# EAGLE design attinytrafficlight (EAGLE 7.5.0)
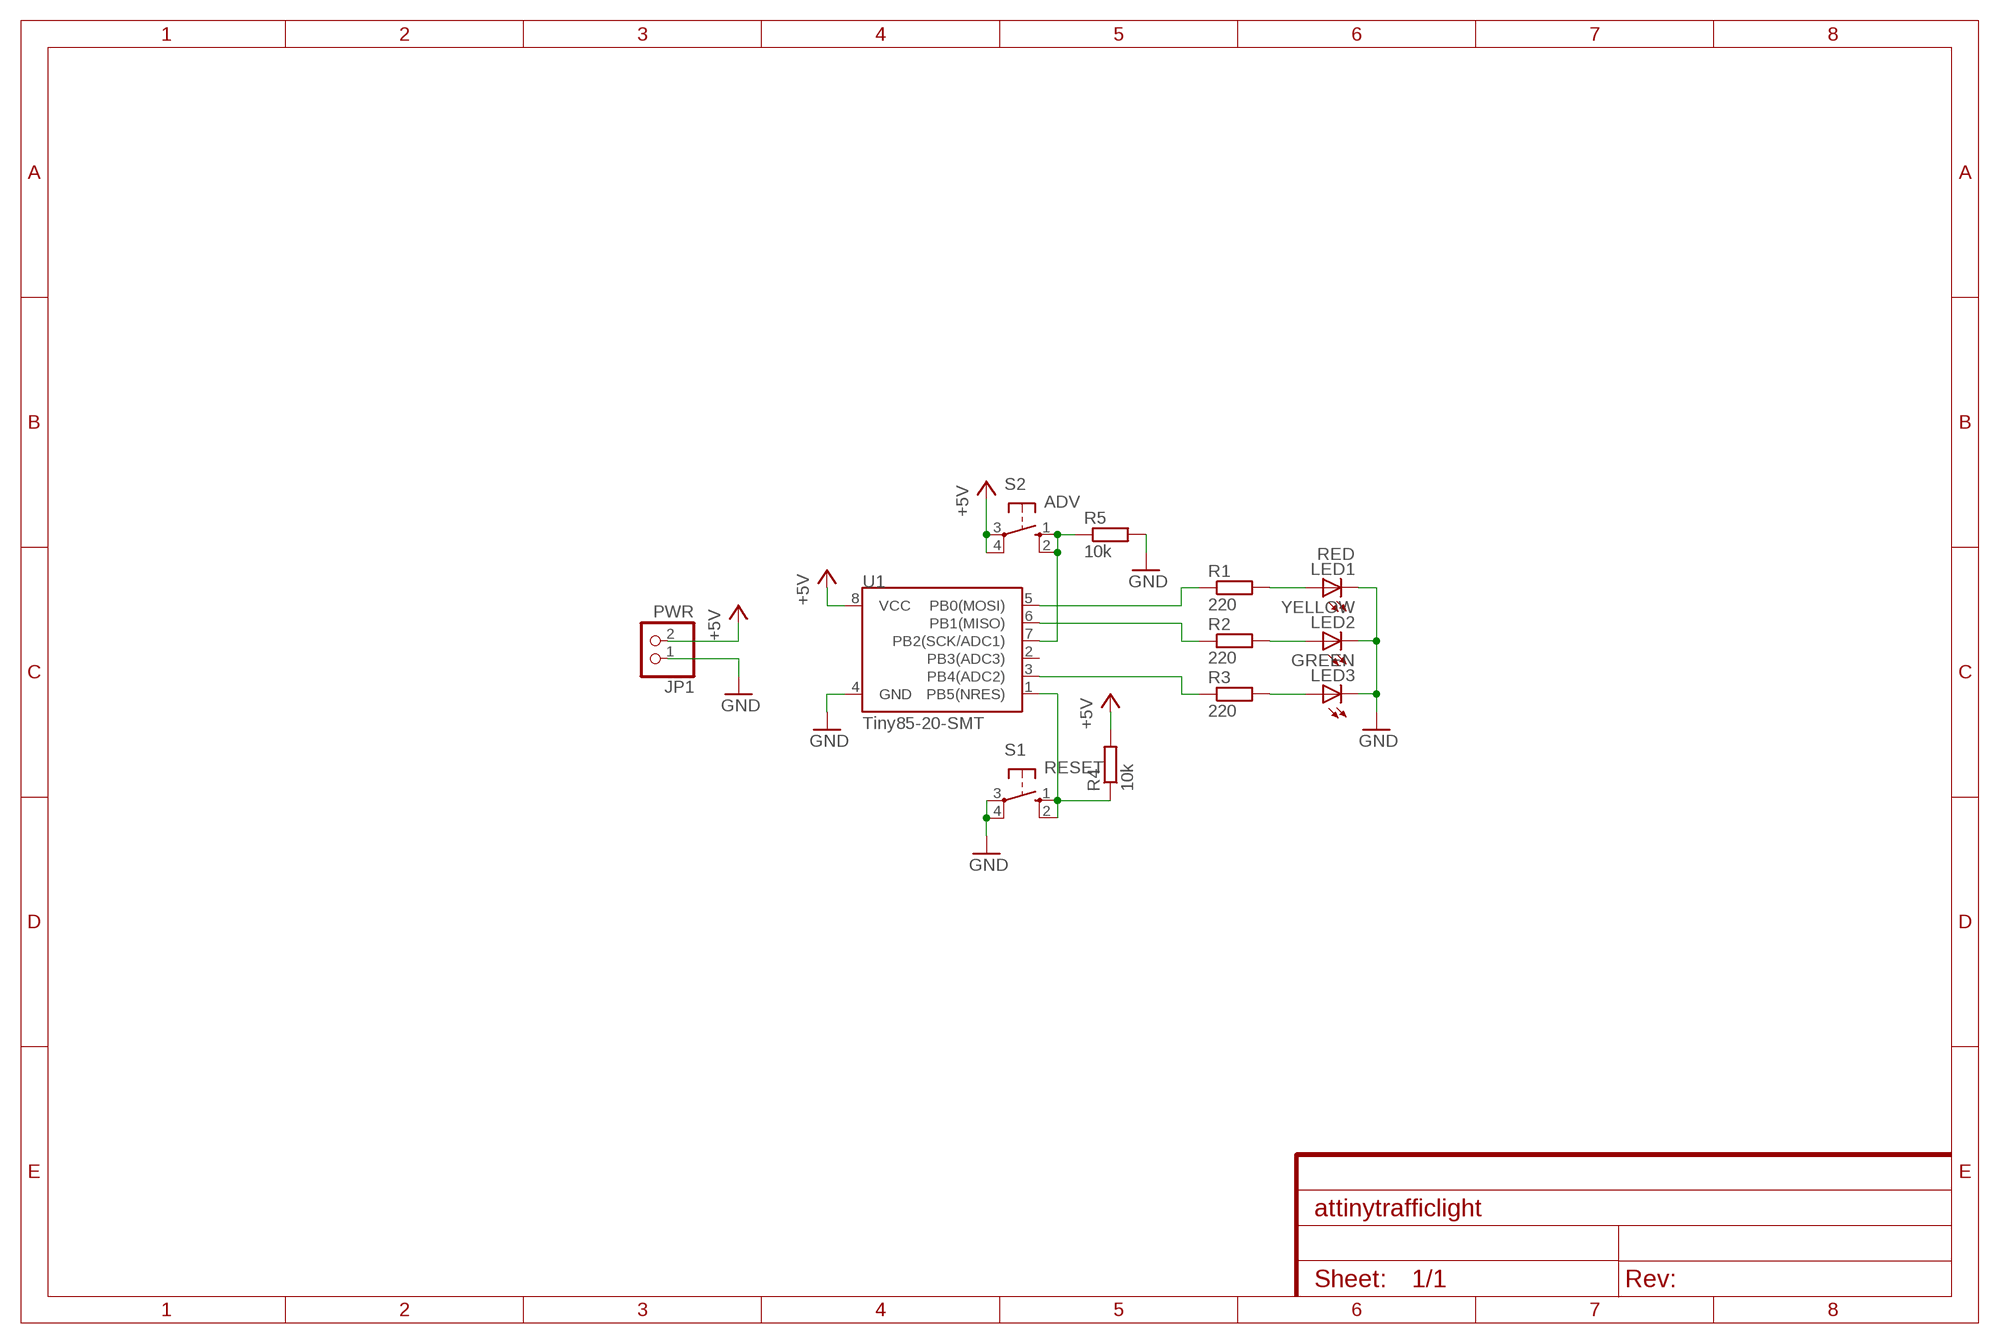
[diagram p0: schematic, sheet 1]

## Parts
JP1  PWR  PINHD-1X2  [1X02]
LED1  RED  LEDSML0805  [SML0805]
LED2  YELLOW  LEDSML0805  [SML0805]
LED3  GREEN  LEDSML0805  [SML0805]
R1  220  R-EU_R0805  [R0805]
R2  220  R-EU_R0805  [R0805]
R3  220  R-EU_R0805  [R0805]
R4  10k  R-EU_R0805  [R0805]
R5  10k  R-EU_R0805  [R0805]
S1  RESET  10-XX  [B3F-10XX]
S2  ADV  10-XX  [B3F-10XX]
U1  Tiny85-20-SMT  ATTINY45TINY85-20-SMT  [SO08-EIAJ]

## Nets
+5V: JP1.2 R4.2 S2.3(P) S2.4(P1) U1.8(VCC)
GND: JP1.1 LED1.C LED2.C LED3.C R5.2 S1.3(P) S1.4(P1) U1.4(GND)
N$1: R4.1 S1.1(S) S1.2(S1) U1.1(PB5(NRES))
N$2: R5.1 S2.1(S) S2.2(S1) U1.7(PB2(SCK/ADC1))
N$4: R1.1 U1.5(PB0(MOSI))
N$5: R2.1 U1.6(PB1(MISO))
N$6: R3.1 U1.3(PB4(ADC2))
N$7: LED1.A R1.2
N$8: LED2.A R2.2
N$9: LED3.A R3.2
Unconnected: U1.2(PB3(ADC3))

## Library data of the parts
JP1 = pinhead:PINHD-1X2: PIN HEADER
LED1-LED3 = led:LED: LED OSRAM: - CHIPLED LG R971, LG N971, LY N971, LG Q971, LY Q971, LO R971, LY R971 LH N974, LH R974 LS Q976, LO Q976, LY Q976 LO Q996 - Hyper CHIPLED LW Q18S LB Q993, LB Q99A, LB R99A - SideLED LS A670, LO A670, LY A670, LG A670, LP A670 LB A673, LV A673, LT A673, LW A673 LH A674 LY A675 LS A676, LA A676, LO A676, LY A676, LW A676 LS A679, LY A679, LG A679 - Hyper Micro SIDELED® LS Y876, LA Y876, LO Y876, LY Y876 LT Y87S - SmartLED LW L88C, LW L88S LB L89C, LB L89S, LG L890 LS L89K, LO L89K, LY L89K LS L896, LA L896, LO L896, LY L896 - TOPLED LS T670, LO T670, LY T670, LG T670, LP T670 LSG T670, LSP T670, LSY T670, LOP T670, LYG T670 LG T671, LOG T671, LSG T671 LB T673, LV T673, LT T673, LW T673 LH T674 LS T676, LA T676, LO T676, LY T676, LB T676, LH T676, LSB T676, LW T676 LB T67C, LV T67C, LT T67C, LS T67K, LO T67K, LY T67K, LW E67C LS E67B, LA E67B, LO E67B, LY E67B, LB E67C, LV E67C, LT E67C LW T67C LS T679, LY T679, LG T679 LS T770, LO T770, LY T770, LG T770, LP T770 LB T773, LV T773, LT T773, LW T773 LH T774 LS E675, LA E675, LY E675, LS T675 LS T776, LA T776, LO T776, LY T776, LB T776 LHGB T686 LT T68C, LB T68C - Hyper Mini TOPLED® LB M676 - Mini TOPLED Santana® LG M470 LS M47K, LO M47K, LY M47K Source: http://www.osram.convergy.de LUXEON: - LUMILED® LXK2-PW12-R00, LXK2-PW12-S00, LXK2-PW14-U00, LXK2-PW14-V00 LXK2-PM12-R00, LXK2-PM12-S00, LXK2-PM14-U00 LXK2-PE12-Q00, LXK2-PE12-R00, LXK2-PE12-S00, LXK2-PE14-T00, LXK2-PE14-U00 LXK2-PB12-K00, LXK2-PB12-L00, LXK2-PB12-M00, LXK2-PB14-N00, LXK2-PB14-P00, LXK2-PB14-Q00 LXK2-PR12-L00, LXK2-PR12-M00, LXK2-PR14-Q00, LXK2-PR14-R00 LXK2-PD12-Q00, LXK2-PD12-R00, LXK2-PD12-S00 LXK2-PH12-R00, LXK2-PH12-S00 LXK2-PL12-P00, LXK2-PL12-Q00, LXK2-PL12-R00 Source: www.luxeon.com KINGBRIGHT: KA-3528ASYC Source: www.kingbright.com
R1-R5 = resistor:R-EU_: RESISTOR, European symbol
S1 S2 = switch-omron:10-XX: OMRON SWITCH; MPN: B3F-1000; OC_FARNELL: 176432; OC_NEWARK: 36M3542
U1 = SparkFun-DigitalIC:ATTINY45: Atmel 8-pin 2/4/8kB flash uC; PROD_ID: IC-09092

## Board
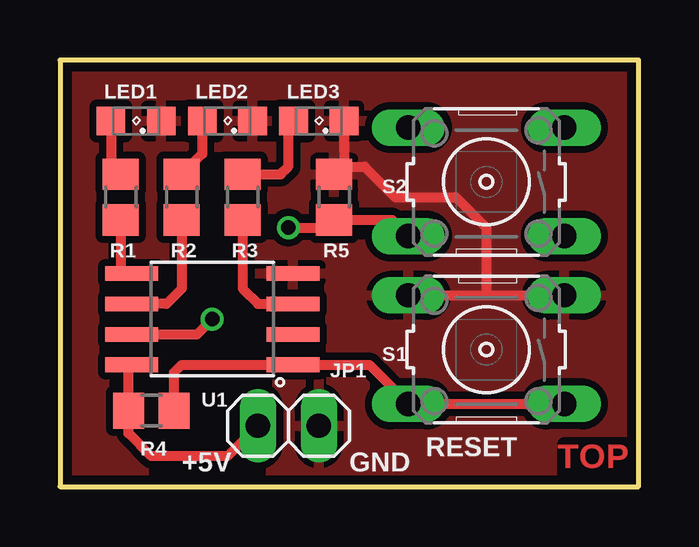
[diagram p1: board, top side]
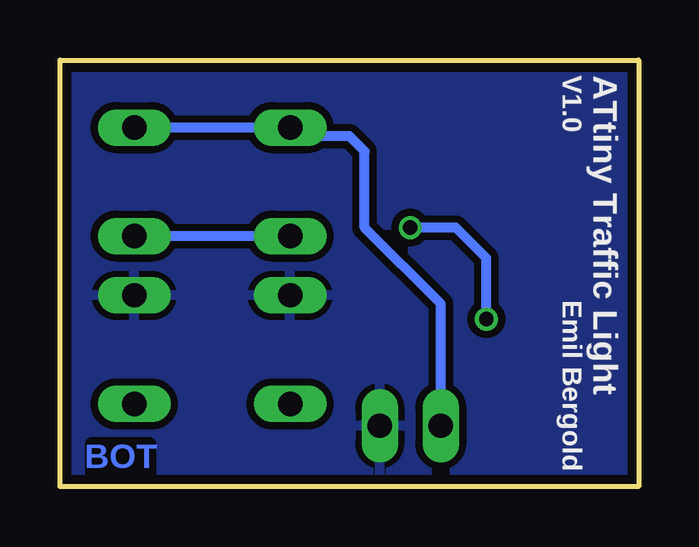
[diagram p2: board, bottom side, seen from below]

Size 24.13 x 17.78 mm. Coordinates in mm from the lower left corner, seen from the top.
Outline: 0,17.78 0,0 24.13,0 24.13,17.78 0,17.78
Copper layers (1*16): Top 0.0356mm / dielectric 1.5011mm / Bottom 0.0356mm
Design rules "OSHPark": minimum track width 6mil, minimum drill 13mil, track to track 6mil, track to pad 6mil, pad to pad 6mil, via to via 6mil, smd to smd 6mil, copper to edge 15mil, drill to drill 6mil, minimum pad ring 7mil, minimum via ring 7mil, stop-mask expansion 3mil, vias tented up to drill 0mil, thermal gap 10mil

### Footprints (pad centres in the part's own frame; a part is rotated, then mirrored left to right if it is on the bottom)
1X02 = drill 1.016 long: 1 -1.27,0; 2 1.27,0
SML0805 = smd 1.2 x 1.2: A 1.05,0; C -1.05,0
R0805 = smd 1.3 x 1.5: 1 -0.95,0; 2 0.95,0
B3F-10XX = drill 1.016 long: 1 -3.251,2.261; 2 3.251,2.261; 3 -3.251,-2.261; 4 3.251,-2.261
SO08-EIAJ = smd 0.61 x 2.21: 1 -1.905,-3.378; 2 -0.635,-3.378; 3 0.635,-3.378; 4 1.905,-3.378; 5 1.905,3.353; 6 0.635,3.353; 7 -0.635,3.353; 8 -1.905,3.353

### Placement (x,y rotation side)
JP1  9.52,2.54 180 top
LED1  3.18,15.24 180 top
LED2  6.98,15.24 180 top
LED3  10.79,15.24 180 top
R1  2.54,12.07 90 top
R2  5.08,12.07 90 top
R3  7.62,12.07 90 top
R4  3.81,3.17 180 top
R5  11.43,12.07 90 top
S1  17.78,5.71 180 top
S2  17.78,12.7 180 top
U1  6.35,6.98 90 top

### Tracks (layer width: path | path; a pad name or v marks a point on that pad's centre or on a via)
+5V
  Top 0.406: U1.8 2.86,4.94 R4.2 2.86,2.22 3.81,1.27 6.98,1.27 JP1.2
  Bottom 0.406: JP1.2 8.25,7.62 11.43,10.79 11.43,13.97 12.06,14.6 14.17,14.6 S2.4 S2.3
GND
  Top 0.406: LED3.C 11.84,13.43 11.75,13.34 | 11.75,13.34 R5.2 | 11.75,13.34 12.7,13.34 13.97,12.07 16.51,12.07 17.78,10.79 17.78,7.98 | S1.4 17.78,7.98 | 17.78,7.98 S1.3
  pour Top (isolate 0.305): 0,17.78 24.13,17.78 24.13,0 0,0
  pour Bottom (isolate 0.305): 0,17.78 24.13,17.78 24.13,0 0,0
N$1
  Top 0.406: R4.1 4.76,4.76 5.08,5.08 U1.1 12.9,5.08 S1.2 S1.1
N$2  (via drill 0.6)
  Top 0.406: U1.7 5.71,6.35 v6.35,6.98 | v9.52,10.79 11.11,10.79 R5.1 13.85,11.12 S2.2
  Bottom 0.406: v6.35,6.98 6.35,9.52 7.62,10.79 v9.52,10.79 | S2.2 S2.1
N$4
  Top 0.406: R1.1 2.54,8.89 U1.5
N$5
  Top 0.406: R2.1 5.08,8.25 4.45,7.62 U1.6
N$6
  Top 0.406: R3.1 7.62,8.25 8.25,7.62 U1.3
N$7
  Top 0.406: 2.12,13.01 R1.2 2.12,13.43 LED1.A
N$8
  Top 0.406: LED2.A 5.93,13.87 R2.2
N$9
  Top 0.406: R3.2 9.2,13.01 9.52,13.34 9.52,15.02 LED3.A

### Text on the board
Top: TOP
Bottom: BOT
tPlace: +5V | GND | RESET
bPlace: ATtiny Traffic Light | V1.0 | Emil Bergold